# Altium schematic sheet retro.SchDoc: Retro
size A4; Organization: Badgerloop Electrical; Address1: 133 Engineering Research Building; Address2: 1500 Engineering Drive; Address3: Madison, Wi 53706
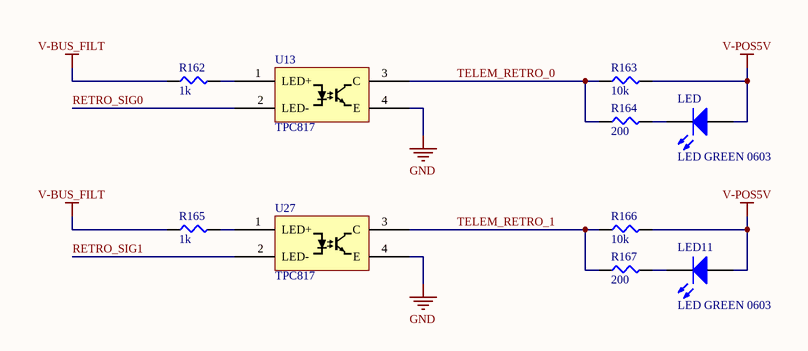
[diagram p0: retro.SchDoc]

## Parts
LED  LED GREEN 0603  [LED 0603 GREEN]
LED11  LED GREEN 0603  [LED 0603 GREEN]
R162  1k  [SMD-0805-RES]
R163  10k  [SMD-0805-RES]
R164  200  [SMD-0805-RES]
R165  1k  [SMD-0805-RES]
R166  10k  [SMD-0805-RES]
R167  200  [SMD-0805-RES]
U13  TPC817  [SOT200P1005X328-5N]
U27  TPC817  [SOT200P1005X328-5N]

## Nets
GND: U13.4(E) U27.4(E)
V-BUS_FILT: R162.1 R165.1
V-POS5V: LED.1(A) LED11.1(A) R163.2 R166.2
RETRO_SIG0: U13.2(LED-)
RETRO_SIG1: U27.2(LED-)
TELEM_RETRO_0: R163.1 R164.1 U13.3(C)
TELEM_RETRO_1: R166.1 R167.1 U27.3(C)
NetLED11_2: LED11.2(K) R167.2
NetLED_2: LED.2(K) R164.2
NetR162_2: R162.2 U13.1(LED+)
NetR165_2: R165.2 U27.1(LED+)

## Notes on the sheet
- Title
- Engineer:
- Date:
- Time:
- Revision:
- Sheet
- of
- File:

## Library data of the parts
LED LED11 = LED GREEN 0603: Manufacturer: Lite-On Inc.; Manufacturer P/N: LTST-C190KGKT; Digikey P/N: 160-1435-1-ND; Package / Case: 0603; Color: GREEN
R162 R165 = ERJ-P06J102V: RES SMD 1K OHM 5% 1/2W 0805; Manufacturer: Panasonic Electronic Components; Factory Stock: 0; Unit Price (USD): 0.01839; @ qty: 1500; Minimum Quantity: 1; Power (Watts): 0.5W, 1/2W; Temperature Coefficient: ±200ppm/°C; Part Number: ERJ-P06J102V; Datasheets: https://industrial.panasonic.com/cdbs/www-data/pdf/RDA0000/AOA0000C243.pdf; Image: //media.digikey.com/Renders/Panasonic%20Renders/ERJ-0805%20Pkg.jpg; Digi-Key Part Number: P1.0KADCT-ND; Quantity Available: 124757; Packaging: Cut Tape (CT); Series: ERJ; Part Status: Active; Value: 1k; Tolerance: ±5%; Composition: Thick Film; Features: Automotive AEC-Q200, Pulse Withstanding; Operating Temperature: -55°C ~ 155°C; Package / Case: 0805 (2012 Metric); Supplier Device Package: 0805; Size / Dimension: 0.079" L x 0.049" W (2.00mm x 1.25mm); Height - Seated (Max): 0.028" (0.70mm); Number of Terminations: 2; Failure Rate: -
R163 R166 = ERJ-P06J103V: RES SMD 10K OHM 5% 1/2W 0805; Manufacturer: Panasonic Electronic Components; Factory Stock: 0; Unit Price (USD): 0.01839; @ qty: 1500; Minimum Quantity: 1; Power (Watts): 0.5W, 1/2W; Temperature Coefficient: ±200ppm/°C; Part Number: ERJ-P06J103V; Datasheets: https://industrial.panasonic.com/cdbs/www-data/pdf/RDA0000/AOA0000C243.pdf; Image: //media.digikey.com/Renders/Panasonic%20Renders/ERJ-0805%20Pkg.jpg; Digi-Key Part Number: P10KADCT-ND; Quantity Available: 413576; Packaging: Cut Tape (CT); Series: ERJ; Part Status: Active; Value: 10k; Tolerance: ±5%; Composition: Thick Film; Features: Automotive AEC-Q200, Pulse Withstanding; Operating Temperature: -55°C ~ 155°C; Package / Case: 0805 (2012 Metric); Supplier Device Package: 0805; Size / Dimension: 0.079" L x 0.049" W (2.00mm x 1.25mm); Height - Seated (Max): 0.028" (0.70mm); Number of Terminations: 2; Failure Rate: -
R164 R167 = ERJ-6ENF2000V: RES SMD 200 OHM 1% 1/8W 0805; Manufacturer: Panasonic Electronic Components; Factory Stock: 0; Unit Price (USD): 0.00729; @ qty: 1500; Minimum Quantity: 1; Power (Watts): 0.125W, 1/8W; Temperature Coefficient: ±100ppm/°C; Part Number: ERJ-6ENF2000V; Datasheets: http://industrial.panasonic.com/www-cgi/jvcr13pz.cgi?E+PZ+3+AOA0002+ERJ6ENF2000V+7+WW; Image: //media.digikey.com/Renders/Panasonic%20Renders/ERJ-0805%20Pkg.jpg; Digi-Key Part Number: P200CCT-ND; Quantity Available: 150759; Packaging: Cut Tape (CT); Series: ERJ; Part Status: Active; Value: 200; Tolerance: ±1%; Composition: Thick Film; Features: Automotive AEC-Q200; Operating Temperature: -55°C ~ 155°C; Package / Case: 0805 (2012 Metric); Supplier Device Package: 0805; Size / Dimension: 0.079" L x 0.049" W (2.00mm x 1.25mm); Height - Seated (Max): 0.028" (0.70mm); Number of Terminations: 2; Failure Rate: -
U13 U27 = TPC817: OPTOISO 5KV TRANS 4SOP; Manufacturer: Taiwan Semi; Manufacturer P/N: TPC817S1B RAG; Digikey Link: https://www.digikey.com/product-detail/en/taiwan-semiconductor-corporation/TPC817S1B-RAG/TPC817S1BRAGCT-ND/7359679; Digikey P/N: TPC817S1BRAGCT-ND